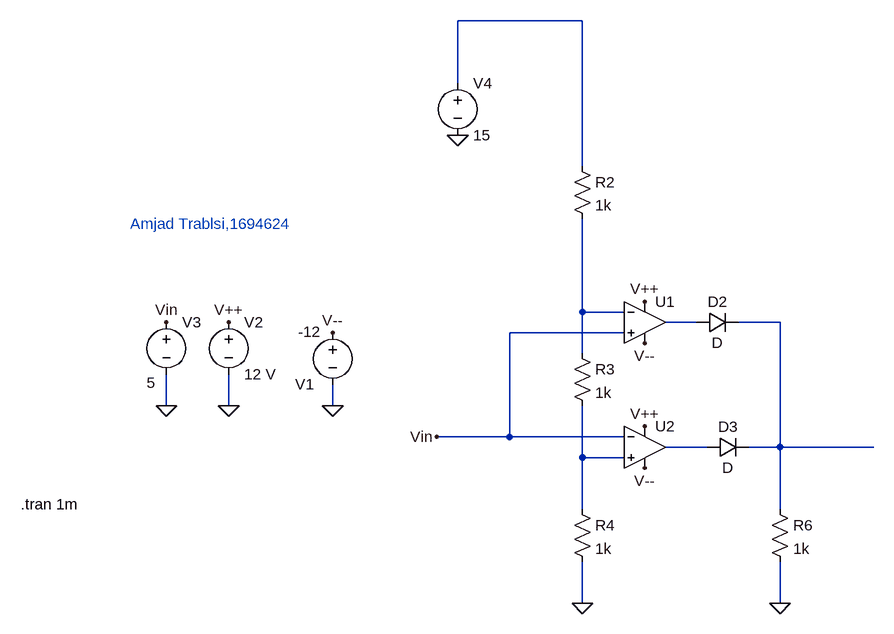
[diagram p0: schematic 4_2 FersterDiskriminator.asc]
4_2 FersterDiskriminator.asc, the LTspice schematic file:
Version 4
SHEET 1 1124 680
WIRE 672 -368 480 -368
WIRE 480 -272 480 -368
WIRE 672 -144 672 -368
WIRE 672 80 672 -64
WIRE 736 80 672 80
WIRE 848 96 800 96
WIRE 976 96 912 96
WIRE 736 112 560 112
WIRE 672 144 672 80
WIRE 32 224 32 176
WIRE 128 224 128 176
WIRE 288 224 288 192
WIRE 560 272 560 112
WIRE 560 272 448 272
WIRE 736 272 560 272
WIRE 864 288 800 288
WIRE 976 288 976 96
WIRE 976 288 928 288
WIRE 1120 288 976 288
WIRE 672 304 672 224
WIRE 736 304 672 304
WIRE 672 384 672 304
WIRE 976 384 976 288
WIRE 672 528 672 464
WIRE 976 528 976 464
FLAG 128 224 0
FLAG 32 224 0
FLAG 32 96 Vin
FLAG 288 224 0
FLAG 128 96 V++
FLAG 288 112 V--
FLAG 672 528 0
FLAG 976 528 0
FLAG 448 272 Vin
FLAG 768 256 V++
FLAG 768 64 V++
FLAG 768 320 V--
FLAG 768 128 V--
FLAG 480 -192 0
SYMBOL voltage 288 96 R0
WINDOW 0 -58 95 Left 2
WINDOW 3 -53 14 Left 2
WINDOW 123 0 0 Left 0
WINDOW 39 0 0 Left 0
SYMATTR InstName V1
SYMATTR Value -12
SYMBOL voltage 128 80 R0
WINDOW 123 0 0 Left 0
WINDOW 39 0 0 Left 0
SYMATTR InstName V2
SYMATTR Value 12 V
SYMBOL voltage 32 80 R0
WINDOW 3 -30 109 Left 2
WINDOW 123 0 0 Left 0
WINDOW 39 0 0 Left 0
SYMATTR InstName V3
SYMATTR Value 5
SYMBOL OpAmps\\UniversalOpAmp 768 96 R0
SYMATTR InstName U1
SYMBOL OpAmps\\UniversalOpAmp 768 288 R0
SYMATTR InstName U2
SYMBOL diode 848 112 R270
WINDOW 0 32 32 VTop 2
WINDOW 3 0 32 VBottom 2
SYMATTR InstName D2
SYMBOL diode 864 304 R270
WINDOW 0 32 32 VTop 2
WINDOW 3 0 32 VBottom 2
SYMATTR InstName D3
SYMBOL res 656 -160 R0
SYMATTR InstName R2
SYMATTR Value 1k
SYMBOL res 656 128 R0
SYMATTR InstName R3
SYMATTR Value 1k
SYMBOL res 656 368 R0
SYMATTR InstName R4
SYMATTR Value 1k
SYMBOL res 960 368 R0
SYMATTR InstName R6
SYMATTR Value 1k
SYMBOL voltage 480 -288 R0
WINDOW 123 0 0 Left 0
WINDOW 39 0 0 Left 0
SYMATTR InstName V4
SYMATTR Value 15
TEXT -24 -56 Left 2 ;Amjad Trablsi,1694624
TEXT -192 376 Left 2 !.tran 1m

The netlist it stands for:
* 4_2 FersterDiskriminator.asc
V1 V-- 0 -12
V2 V++ 0 12 V
V3 Vin 0 5
XU1 Vin N002 V++ V-- N003 level1 Avol=1Meg GBW=10Meg Vos=0 En=0 Enk=0 In=0 Ink=0 Rin=500Meg  ; pins In+ In- V+ V- OUT
XU2 N006 Vin V++ V-- N005 level1 Avol=1Meg GBW=10Meg Vos=0 En=0 Enk=0 In=0 Ink=0 Rin=500Meg  ; pins In+ In- V+ V- OUT
D2 N003 N004 D
D3 N005 N004 D
R2 N001 N002 1k
R3 N002 N006 1k
R4 N006 0 1k
R6 N004 0 1k
V4 N001 0 15
.model D D
.lib standard.dio
* Amjad Trablsi,1694624
.tran 1m
.lib UniversalOpAmp1.lib
.backanno
.end